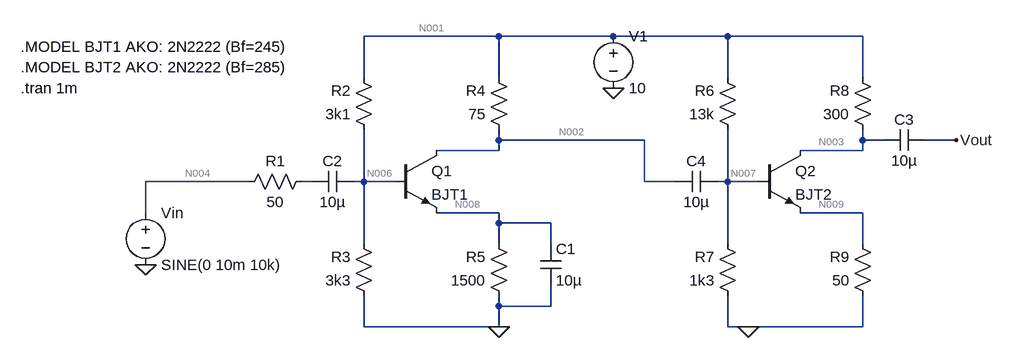
[diagram p0: schematic Simulasi Rangkaian.asc]
Simulasi Rangkaian.asc, the LTspice schematic file:
Version 4
SHEET 1 1192 680
WIRE 416 -16 208 -16
WIRE 592 -16 416 -16
WIRE 768 -16 592 -16
WIRE 976 -16 768 -16
WIRE 208 48 208 -16
WIRE 416 48 416 -16
WIRE 768 48 768 -16
WIRE 976 48 976 -16
WIRE 416 144 416 128
WIRE 640 144 416 144
WIRE 976 144 976 128
WIRE 1008 144 976 144
WIRE 1120 144 1072 144
WIRE 416 160 416 144
WIRE 416 160 320 160
WIRE 976 160 976 144
WIRE 976 160 880 160
WIRE 32 208 -128 208
WIRE 128 208 112 208
WIRE 208 208 208 128
WIRE 208 208 192 208
WIRE 256 208 208 208
WIRE 640 208 640 144
WIRE 688 208 640 208
WIRE 768 208 768 128
WIRE 768 208 752 208
WIRE 816 208 768 208
WIRE -128 256 -128 208
WIRE 416 256 320 256
WIRE 976 256 880 256
WIRE 416 272 416 256
WIRE 496 272 416 272
WIRE 208 304 208 208
WIRE 416 304 416 272
WIRE 496 304 496 272
WIRE 768 304 768 208
WIRE 976 304 976 256
WIRE 416 400 416 384
WIRE 496 400 496 368
WIRE 496 400 416 400
WIRE 208 432 208 384
WIRE 416 432 416 400
WIRE 416 432 208 432
WIRE 768 432 768 384
WIRE 800 432 768 432
WIRE 976 432 976 384
WIRE 976 432 800 432
FLAG 800 432 0
FLAG 416 432 0
FLAG -128 336 0
FLAG 592 64 0
FLAG 1120 144 Vout
SYMBOL res 128 192 R90
WINDOW 0 0 56 VBottom 2
WINDOW 3 32 56 VTop 2
SYMATTR InstName R1
SYMATTR Value 50
SYMBOL res 224 144 R180
WINDOW 0 36 76 Left 2
WINDOW 3 36 40 Left 2
SYMATTR InstName R2
SYMATTR Value 3k1
SYMBOL res 224 400 R180
WINDOW 0 36 76 Left 2
WINDOW 3 36 40 Left 2
SYMATTR InstName R3
SYMATTR Value 3k3
SYMBOL res 432 144 R180
WINDOW 0 36 76 Left 2
WINDOW 3 36 40 Left 2
SYMATTR InstName R4
SYMATTR Value 75
SYMBOL res 432 400 R180
WINDOW 0 36 76 Left 2
WINDOW 3 36 40 Left 2
SYMATTR InstName R5
SYMATTR Value 1500
SYMBOL npn 256 160 R0
SYMATTR InstName Q1
SYMATTR Value BJT1
SYMBOL cap 480 304 R0
SYMATTR InstName C1
SYMATTR Value 10µ
SYMBOL cap 192 192 R90
WINDOW 0 0 32 VBottom 2
WINDOW 3 32 32 VTop 2
SYMATTR InstName C2
SYMATTR Value 10µ
SYMBOL res 784 144 R180
WINDOW 0 36 76 Left 2
WINDOW 3 36 40 Left 2
SYMATTR InstName R6
SYMATTR Value 13k
SYMBOL res 784 400 R180
WINDOW 0 36 76 Left 2
WINDOW 3 36 40 Left 2
SYMATTR InstName R7
SYMATTR Value 1k3
SYMBOL res 992 144 R180
WINDOW 0 36 76 Left 2
WINDOW 3 36 40 Left 2
SYMATTR InstName R8
SYMATTR Value 300
SYMBOL res 992 400 R180
WINDOW 0 36 76 Left 2
WINDOW 3 36 40 Left 2
SYMATTR InstName R9
SYMATTR Value 50
SYMBOL npn 816 160 R0
SYMATTR InstName Q2
SYMATTR Value BJT2
SYMBOL cap 752 192 R90
WINDOW 0 0 32 VBottom 2
WINDOW 3 32 32 VTop 2
SYMATTR InstName C4
SYMATTR Value 10µ
SYMBOL cap 1072 128 R90
WINDOW 0 0 32 VBottom 2
WINDOW 3 32 32 VTop 2
SYMATTR InstName C3
SYMATTR Value 10µ
SYMBOL voltage 592 -32 R0
SYMATTR InstName V1
SYMATTR Value 10
SYMBOL voltage -128 240 R0
WINDOW 123 0 0 Left 0
WINDOW 39 0 0 Left 0
SYMATTR InstName Vin
SYMATTR Value SINE(0 10m 10k)
TEXT -320 0 Left 2 !.MODEL BJT1 AKO: 2N2222 (Bf=245)
TEXT -320 32 Left 2 !.MODEL BJT2 AKO: 2N2222 (Bf=285)
TEXT -320 64 Left 2 !.tran 1m

The netlist it stands for:
* Simulasi Rangkaian.asc
R1 N005 N004 50
R2 N006 N001 3k1
R3 0 N006 3k3
R4 N002 N001 75
R5 0 N008 1500
Q1 N002 N006 N008 0 BJT1
C1 N008 0 10µ
C2 N006 N005 10µ
R6 N007 N001 13k
R7 0 N007 1k3
R8 N003 N001 300
R9 0 N009 50
Q2 N003 N007 N009 0 BJT2
C4 N007 N002 10µ
C3 Vout N003 10µ
V1 N001 0 10
Vin N004 0 SINE(0 10m 10k)
.model NPN NPN
.model PNP PNP
.lib standard.bjt
.MODEL BJT1 AKO: 2N2222 (Bf=245)
.MODEL BJT2 AKO: 2N2222 (Bf=285)
.tran 1m
.backanno
.end

* Results of the author's LTspice run, read from the files saved beside the schematic
* Operating Point, zero values left out:
*   V(n006) = 5.138 V
*   V(n001) = 10 V
*   V(n002) = 9.778 V
*   V(n008) = 4.455 V
*   V(n007) = 893.4 mV
*   V(n003) = 8.787 V
*   V(n009) = 202.8 mV
*   V(vout) = 87.87 µV
*   Ic(Q2) = 4.043 mA
*   Ib(Q2) = 13.31 µA
*   Ie(Q2) = -4.056 mA
*   Ic(Q1) = 2.958 mA
*   Ib(Q1) = 11.65 µA
*   Ie(Q1) = -2.97 mA
*   I(R9) = -4.056 mA
*   I(R8) = -4.043 mA
*   I(R7) = -687.2 µA
*   I(R6) = -700.5 µA
*   I(R5) = -2.97 mA
*   I(R4) = -2.958 mA
*   I(R3) = -1.557 mA
*   I(R2) = -1.569 mA
*   I(V1) = -9.27 mA
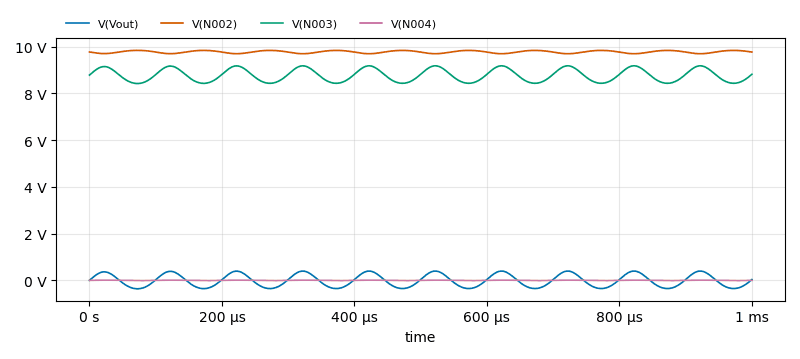
[diagram p1: Transient Analysis of Simulasi Rangkaian.asc, plotted from the saved traces]
* Transient Analysis, 1 run:
*   V(Vout): min -361.4 mV, max 397.4 mV, average -6.51 mV, rms 263.6 mV, last 35.02 mV
*   V(N002): min 9.701 V, max 9.846 V, average 9.779 V, rms 9.779 V, last 9.772 V
*   V(N003): min 8.426 V, max 9.184 V, average 8.781 V, rms 8.785 V, last 8.822 V
*   V(N004): min -10 mV, max 9.995 mV, average -266.8 nV, rms 7.07 mV, last 0 V